# Altium schematic sheet MCU-Debug.SchDoc: =ProjectTitle
size 297 x 209 mm; Address1: Address1; Address2: Address2; Address3: Address3; Address4: Address4; SheetNumber: 3; SheetTotal: 7; Scale: 1:1; DocumentType: Схема электрическая принципиальная
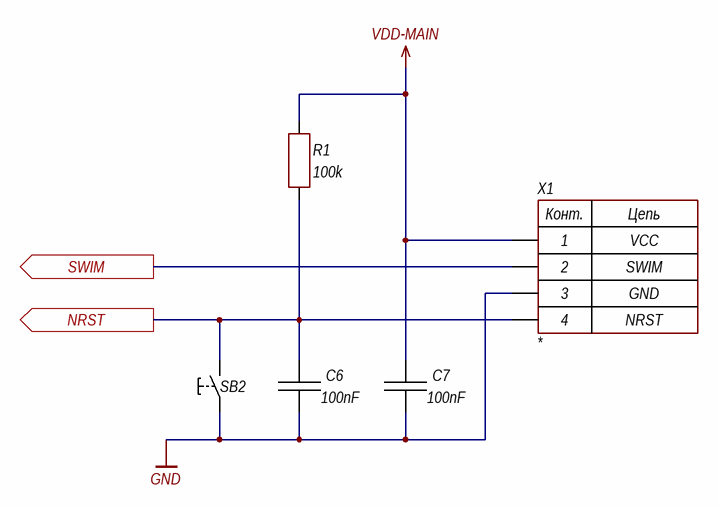
[diagram p0: MCU-Debug.SchDoc]

## Parts
C6  100nF  [CH0402C]
C7  100nF  [CH0402C]
R1  100k  [CH0402R]
SB2  "Кнопка"  [BUT: YTS-A017]  (value not drawn)
X1  *  [CON: PLS-4]

## Ports
NRST (out), SWIM (out)

## Nets
GND: C6.1 C7.1 SB2.1 X1.3
VDD-MAIN: C7.2 R1.2 X1.1
NRST: C6.2 R1.1 SB2.2 X1.4 ; port NRST
SWIM: X1.2 ; port SWIM

## Notes on the sheet
- VCC
- SWIM
- GND
- NRST
- Изм.
- Лист
- № докум.
- Подп.
- Дата
- Копировал
- Формат А4
- (in symbol 4-Connector) Конт.; Цепь

## Library data of the parts
C6 C7 = Capacitor: Manufacturer: *; Model: *; HelpURL: *; ComponentKind: *; Value: 100nF
R1 = Resistor: Manufacturer: *; Model: *; HelpURL: *; ComponentKind: *; Value: 100k
SB2 = 1-Button: Button, no latching; Manufacturer: *; Model: *; HelpURL: *; ComponentKind: *
X1 = 4-Connector: Model: *; Manufacturer: *; HelpURL: *; ComponentKind: *